# Altium schematic sheet Urukul.SchDoc: =DocumentName
size A3; DocumentNumber: 1; Revision: 0; SheetNumber: 1; SheetTotal: 20; Last modified by: Krzysztof Belewicz
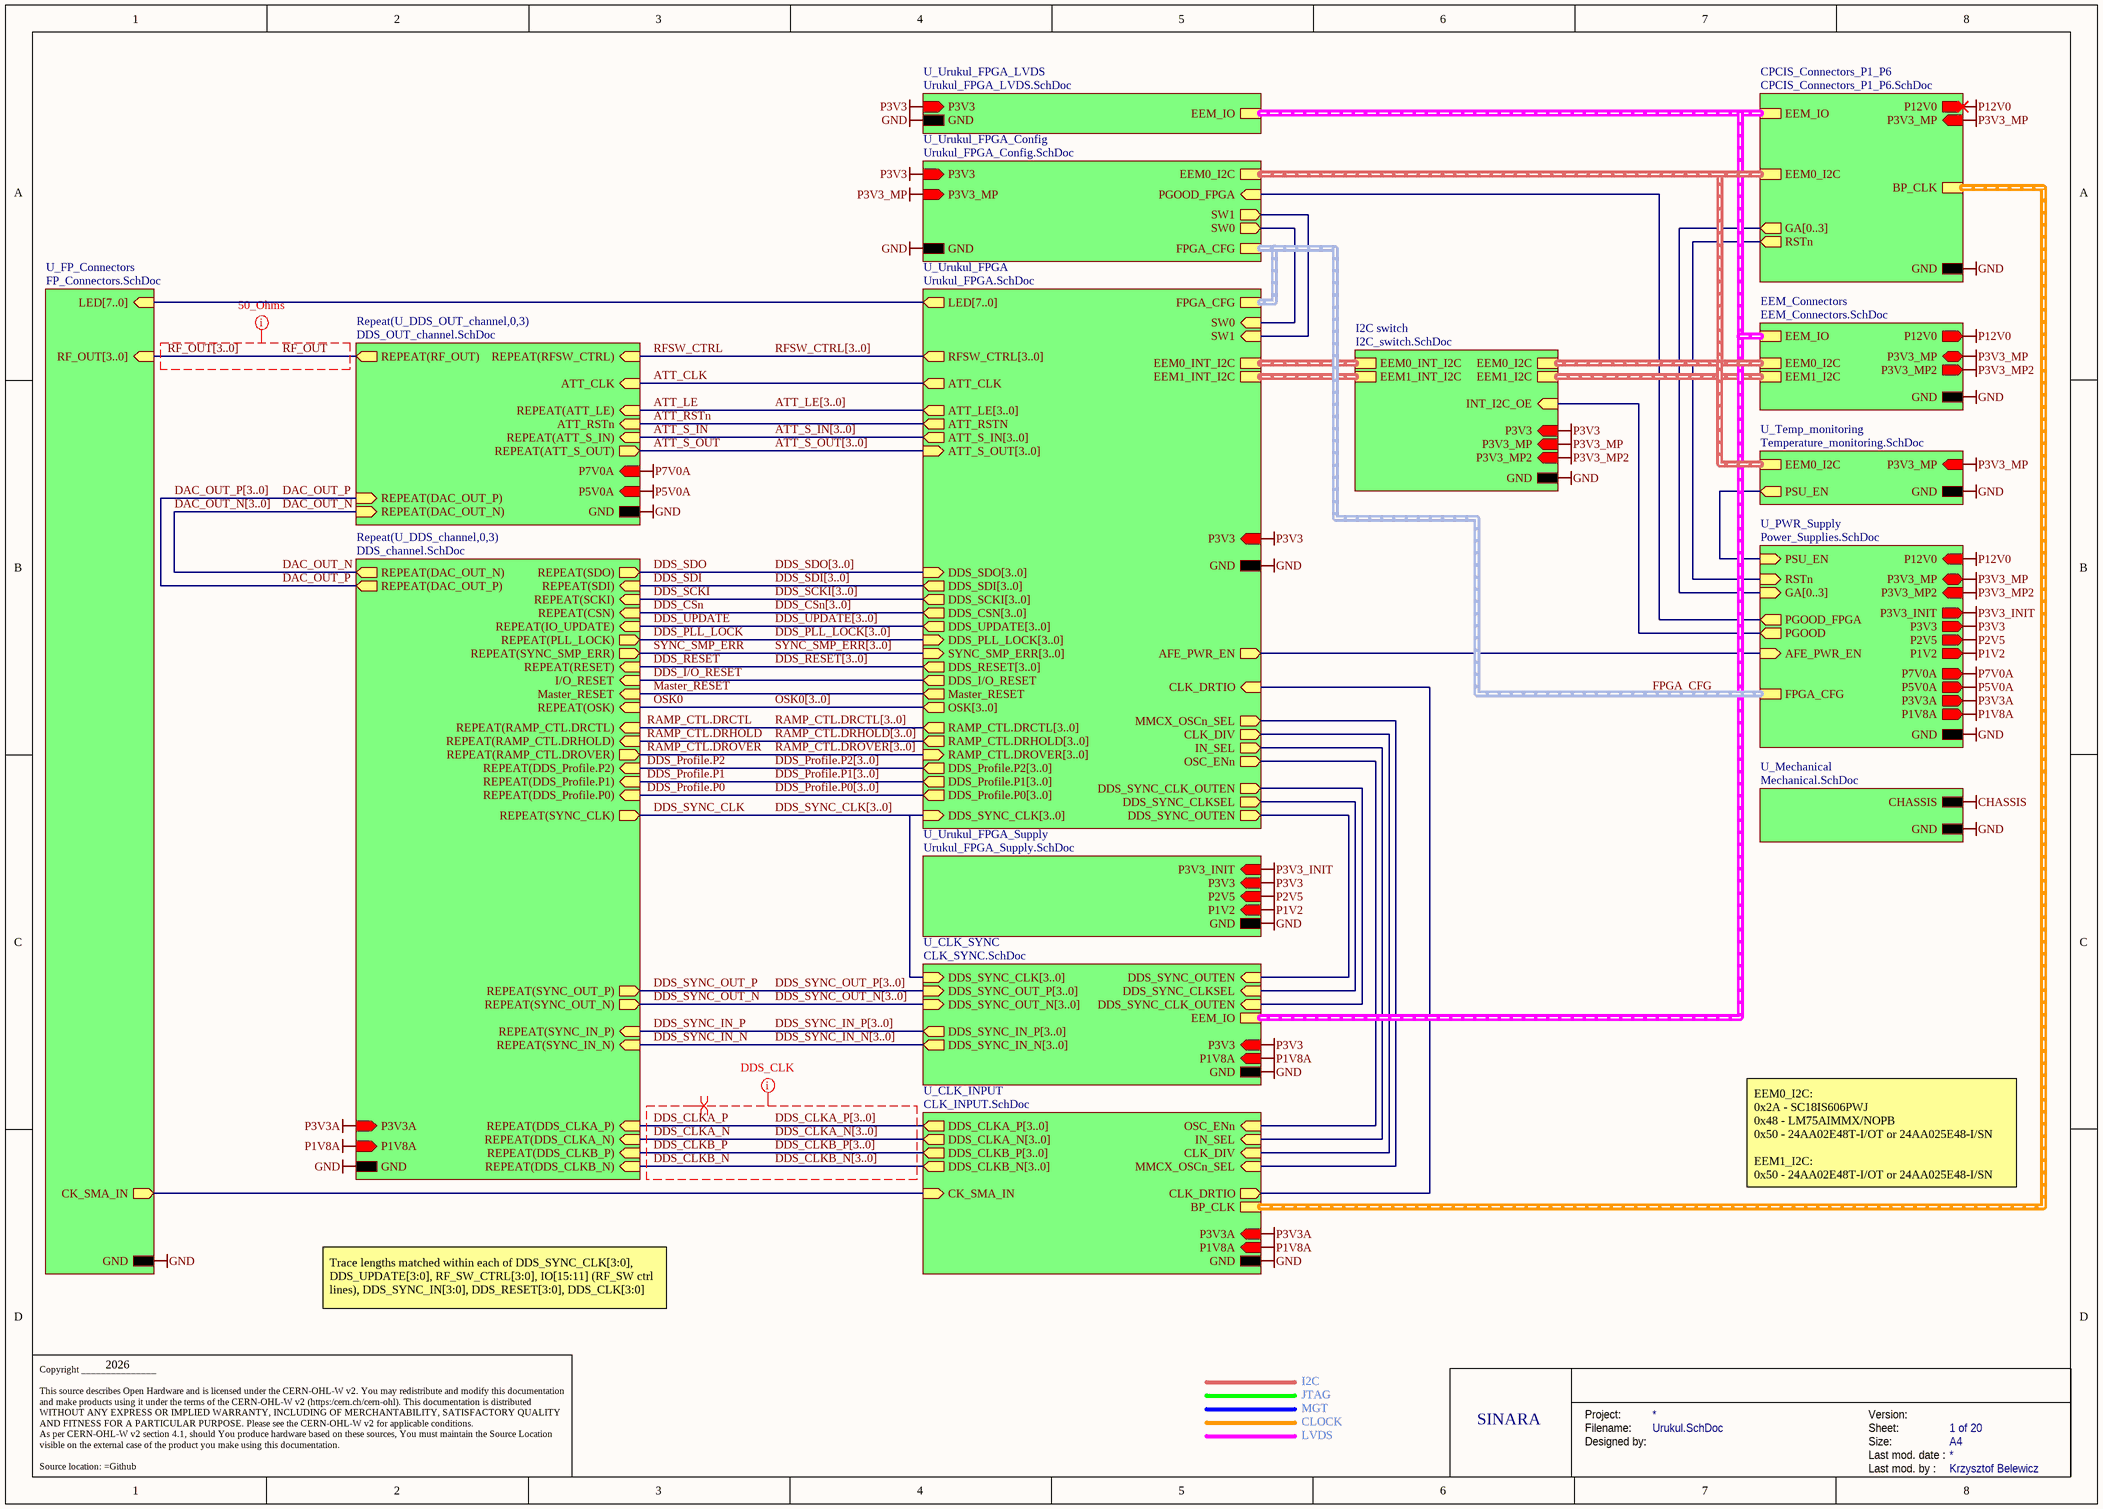
[diagram p0: Urukul.SchDoc]

## Sub-sheets
CPCIS_Connectors_P1_P6 = CPCIS_Connectors_P1_P6.SchDoc: P12V0 (out), P3V3_MP (in), EEM_IO (harness EEM_LVDS), EEM0_I2C (harness I2C), BP_CLK (harness CLK_DIFF), GA[0..3] (out), GND, RSTn (out)
EEM_Connectors = EEM_Connectors.SchDoc: P3V3_MP (bidir), P12V0 (out), EEM_IO (harness EEM_LVDS), EEM0_I2C (harness I2C), GND, P3V3_MP2 (out), EEM1_I2C (harness I2C)
I2C switch = I2C_switch.SchDoc: GND, P3V3 (in), P3V3_MP (in), INT_I2C_OE (in), EEM0_I2C (harness I2C), EEM1_I2C (harness I2C), EEM0_INT_I2C (harness I2C), EEM1_INT_I2C (harness I2C), P3V3_MP2 (in)
Repeat(U_DDS_channel,0,3) = DDS_channel.SchDoc: REPEAT(CSN) (in), REPEAT(SDI) (in), REPEAT(SCKI) (in), REPEAT(SDO) (out), REPEAT(DAC_OUT_P) (out), REPEAT(DAC_OUT_N) (out), REPEAT(RESET) (in), REPEAT(IO_UPDATE) (in), REPEAT(SYNC_CLK) (out), I/O_RESET (in), REPEAT(SYNC_SMP_ERR) (out), REPEAT(PLL_LOCK) (out), Master_RESET (in), REPEAT(OSK) (in), GND, P1V8A (in), P3V3A (in), REPEAT(SYNC_IN_P) (in), REPEAT(SYNC_IN_N) (in), REPEAT(SYNC_OUT_P) (out), REPEAT(SYNC_OUT_N) (out), REPEAT(DDS_CLKB_P) (in), REPEAT(DDS_CLKB_N) (in), REPEAT(DDS_CLKA_P) (in), REPEAT(DDS_CLKA_N) (in), REPEAT(RAMP_CTL.DROVER) (out), REPEAT(RAMP_CTL.DRHOLD) (in), REPEAT(RAMP_CTL.DRCTL) (in), REPEAT(DDS_Profile.P2) (in), REPEAT(DDS_Profile.P1) (in), REPEAT(DDS_Profile.P0) (in)
Repeat(U_DDS_OUT_channel,0,3) = DDS_OUT_channel.SchDoc: REPEAT(RF_OUT) (out), REPEAT(RFSW_CTRL) (in), ATT_CLK (in), REPEAT(ATT_S_IN) (in), REPEAT(ATT_LE) (in), ATT_RSTn (in), REPEAT(ATT_S_OUT) (out), GND, P7V0A (in), P5V0A (in), REPEAT(DAC_OUT_P) (in), REPEAT(DAC_OUT_N) (in)
U_CLK_INPUT = CLK_INPUT.SchDoc: DDS_CLKA_P[3..0] (out), DDS_CLKA_N[3..0] (out), BP_CLK (harness CLK_DIFF), CK_SMA_IN (in), IN_SEL (in), CLK_DIV (in), MMCX_OSCn_SEL (in), OSC_ENn (in), DDS_CLKB_P[3..0] (out), DDS_CLKB_N[3..0] (out), P3V3A (in), GND, P1V8A (in), CLK_DRTIO (out)
U_CLK_SYNC = CLK_SYNC.SchDoc: DDS_SYNC_OUT_P[3..0] (in), DDS_SYNC_OUT_N[3..0] (in), DDS_SYNC_IN_P[3..0] (out), DDS_SYNC_IN_N[3..0] (out), DDS_SYNC_CLK_OUTEN (in), DDS_SYNC_CLKSEL (in), DDS_SYNC_OUTEN (in), EEM_IO (harness EEM_LVDS), DDS_SYNC_CLK[3..0] (in), GND, P3V3 (in), P1V8A (in)
U_FP_Connectors = FP_Connectors.SchDoc: GND, CK_SMA_IN (out), LED[7..0] (in), RF_OUT[3..0] (in)
U_Mechanical = Mechanical.SchDoc: CHASSIS, GND
U_PWR_Supply = Power_Supplies.SchDoc: GND, P12V0 (in), P3V3 (out), P3V3_MP (bidir), PGOOD (out), GA[0..3] (in), RSTn (in), PSU_EN (in), P3V3_MP2 (in), P3V3_INIT (out), P2V5 (out), P1V2 (out), P3V3A (out), P1V8A (out), P5V0A (out), P7V0A (out), AFE_PWR_EN (in), PGOOD_FPGA (out), FPGA_CFG (harness FPGA_CFG)
U_Temp_monitoring = Temperature_monitoring.SchDoc: GND, P3V3_MP (in), EEM0_I2C (harness I2C), PSU_EN (out)
U_Urukul_FPGA = Urukul_FPGA.SchDoc: EEM0_INT_I2C (harness I2C), EEM1_INT_I2C (harness I2C), LED[7..0] (out), FPGA_CFG (harness FPGA_CFG), SW0 (in), RFSW_CTRL[3..0] (out), DDS_SYNC_CLK[3..0] (in), ATT_S_IN[3..0] (out), ATT_S_OUT[3..0] (in), OSK[3..0] (out), ATT_CLK (out), ATT_LE[3..0] (out), ATT_RSTN (out), Master_RESET (out), DDS_UPDATE[3..0] (out), DDS_CSN[3..0] (out), DDS_SCKI[3..0] (out), DDS_SDI[3..0] (out), DDS_SDO[3..0] (in), DDS_I/O_RESET (out), DDS_PLL_LOCK[3..0] (in), SYNC_SMP_ERR[3..0] (in), DDS_RESET[3..0] (out), SW1 (in), GND, P3V3 (in), AFE_PWR_EN (out), DDS_SYNC_CLKSEL (out), DDS_SYNC_OUTEN (out), DDS_SYNC_CLK_OUTEN (out), IN_SEL (out), CLK_DIV (out), MMCX_OSCn_SEL (out), OSC_ENn (out), CLK_DRTIO (in), RAMP_CTL.DRCTL[3..0] (out), RAMP_CTL.DRHOLD[3..0] (out), RAMP_CTL.DROVER[3..0] (in), DDS_Profile.P2[3..0] (out), DDS_Profile.P1[3..0] (out), DDS_Profile.P0[3..0] (out)
U_Urukul_FPGA_Config = Urukul_FPGA_Config.SchDoc: PGOOD_FPGA (in), FPGA_CFG (harness FPGA_CFG), SW0 (out), SW1 (out), GND, P3V3_MP (in), P3V3 (in), EEM0_I2C (harness I2C)
U_Urukul_FPGA_LVDS = Urukul_FPGA_LVDS.SchDoc: EEM_IO (harness EEM_LVDS), GND, P3V3 (in)
U_Urukul_FPGA_Supply = Urukul_FPGA_Supply.SchDoc: P3V3_INIT (in), P3V3 (in), P2V5 (in), P1V2 (in), GND

## Nets
CHASSIS: sheet U_Mechanical/CHASSIS
GND: sheet CPCIS_Connectors_P1_P6/GND, sheet EEM_Connectors/GND, sheet U_Temp_monitoring/GND, sheet U_Mechanical/GND, sheet U_FP_Connectors/GND, sheet U_CLK_INPUT/GND, sheet U_Urukul_FPGA_Supply/GND, sheet Repeat(U_DDS_OUT_channel,0,3)/GND, sheet Repeat(U_DDS_channel,0,3)/GND, sheet U_Urukul_FPGA/GND, sheet U_CLK_SYNC/GND, sheet U_Urukul_FPGA_Config/GND, sheet U_Urukul_FPGA_LVDS/GND, sheet I2C switch/GND, sheet U_PWR_Supply/GND
P1V2: sheet U_Urukul_FPGA_Supply/P1V2, sheet U_PWR_Supply/P1V2
P1V8A: sheet U_CLK_INPUT/P1V8A, sheet Repeat(U_DDS_channel,0,3)/P1V8A, sheet U_CLK_SYNC/P1V8A, sheet U_PWR_Supply/P1V8A
P2V5: sheet U_Urukul_FPGA_Supply/P2V5, sheet U_PWR_Supply/P2V5
P3V3: sheet U_Urukul_FPGA_Supply/P3V3, sheet U_Urukul_FPGA/P3V3, sheet U_CLK_SYNC/P3V3, sheet U_Urukul_FPGA_Config/P3V3, sheet U_Urukul_FPGA_LVDS/P3V3, sheet I2C switch/P3V3, sheet U_PWR_Supply/P3V3
P3V3_INIT: sheet U_Urukul_FPGA_Supply/P3V3_INIT, sheet U_PWR_Supply/P3V3_INIT
P3V3_MP: sheet CPCIS_Connectors_P1_P6/P3V3_MP, sheet EEM_Connectors/P3V3_MP, sheet U_Temp_monitoring/P3V3_MP, sheet U_Urukul_FPGA_Config/P3V3_MP, sheet I2C switch/P3V3_MP, sheet U_PWR_Supply/P3V3_MP
P3V3_MP2: sheet EEM_Connectors/P3V3_MP2, sheet I2C switch/P3V3_MP2, sheet U_PWR_Supply/P3V3_MP2
P3V3A: sheet U_CLK_INPUT/P3V3A, sheet Repeat(U_DDS_channel,0,3)/P3V3A, sheet U_PWR_Supply/P3V3A
P5V0A: sheet Repeat(U_DDS_OUT_channel,0,3)/P5V0A, sheet U_PWR_Supply/P5V0A
P7V0A: sheet Repeat(U_DDS_OUT_channel,0,3)/P7V0A, sheet U_PWR_Supply/P7V0A
P12V0: sheet CPCIS_Connectors_P1_P6/P12V0, sheet EEM_Connectors/P12V0, sheet U_PWR_Supply/P12V0
ATT_CLK: sheet Repeat(U_DDS_OUT_channel,0,3)/ATT_CLK, sheet U_Urukul_FPGA/ATT_CLK
ATT_LE: sheet Repeat(U_DDS_OUT_channel,0,3)/REPEAT(ATT_LE)
ATT_RSTn: sheet Repeat(U_DDS_OUT_channel,0,3)/ATT_RSTn, sheet U_Urukul_FPGA/ATT_RSTN
ATT_S_IN: sheet Repeat(U_DDS_OUT_channel,0,3)/REPEAT(ATT_S_IN)
ATT_S_OUT: sheet Repeat(U_DDS_OUT_channel,0,3)/REPEAT(ATT_S_OUT)
DAC_OUT_N: sheet Repeat(U_DDS_OUT_channel,0,3)/REPEAT(DAC_OUT_N), sheet Repeat(U_DDS_channel,0,3)/REPEAT(DAC_OUT_N)
DAC_OUT_P: sheet Repeat(U_DDS_OUT_channel,0,3)/REPEAT(DAC_OUT_P), sheet Repeat(U_DDS_channel,0,3)/REPEAT(DAC_OUT_P)
DDS_CLKA_N: sheet Repeat(U_DDS_channel,0,3)/REPEAT(DDS_CLKA_N)
DDS_CLKA_P: sheet Repeat(U_DDS_channel,0,3)/REPEAT(DDS_CLKA_P)
DDS_CLKB_N: sheet Repeat(U_DDS_channel,0,3)/REPEAT(DDS_CLKB_N)
DDS_CLKB_P: sheet Repeat(U_DDS_channel,0,3)/REPEAT(DDS_CLKB_P)
DDS_CSn: sheet Repeat(U_DDS_channel,0,3)/REPEAT(CSN)
DDS_I/O_RESET: sheet Repeat(U_DDS_channel,0,3)/I/O_RESET, sheet U_Urukul_FPGA/DDS_I/O_RESET
DDS_PLL_LOCK: sheet Repeat(U_DDS_channel,0,3)/REPEAT(PLL_LOCK)
DDS_Profile.P0: sheet Repeat(U_DDS_channel,0,3)/REPEAT(DDS_Profile.P0)
DDS_Profile.P1: sheet Repeat(U_DDS_channel,0,3)/REPEAT(DDS_Profile.P1)
DDS_Profile.P2: sheet Repeat(U_DDS_channel,0,3)/REPEAT(DDS_Profile.P2)
DDS_RESET: sheet Repeat(U_DDS_channel,0,3)/REPEAT(RESET)
DDS_SCKI: sheet Repeat(U_DDS_channel,0,3)/REPEAT(SCKI)
DDS_SDI: sheet Repeat(U_DDS_channel,0,3)/REPEAT(SDI)
DDS_SDO: sheet Repeat(U_DDS_channel,0,3)/REPEAT(SDO)
DDS_SYNC_CLK: sheet Repeat(U_DDS_channel,0,3)/REPEAT(SYNC_CLK)
DDS_SYNC_IN_N: sheet Repeat(U_DDS_channel,0,3)/REPEAT(SYNC_IN_N)
DDS_SYNC_IN_P: sheet Repeat(U_DDS_channel,0,3)/REPEAT(SYNC_IN_P)
DDS_SYNC_OUT_N: sheet Repeat(U_DDS_channel,0,3)/REPEAT(SYNC_OUT_N)
DDS_SYNC_OUT_P: sheet Repeat(U_DDS_channel,0,3)/REPEAT(SYNC_OUT_P)
DDS_UPDATE: sheet Repeat(U_DDS_channel,0,3)/REPEAT(IO_UPDATE)
Master_RESET: sheet Repeat(U_DDS_channel,0,3)/Master_RESET, sheet U_Urukul_FPGA/Master_RESET
OSK0: sheet Repeat(U_DDS_channel,0,3)/REPEAT(OSK)
RAMP_CTL.DRCTL: sheet Repeat(U_DDS_channel,0,3)/REPEAT(RAMP_CTL.DRCTL)
RAMP_CTL.DRHOLD: sheet Repeat(U_DDS_channel,0,3)/REPEAT(RAMP_CTL.DRHOLD)
RAMP_CTL.DROVER: sheet Repeat(U_DDS_channel,0,3)/REPEAT(RAMP_CTL.DROVER)
RF_OUT: sheet Repeat(U_DDS_OUT_channel,0,3)/REPEAT(RF_OUT)
RFSW_CTRL: sheet Repeat(U_DDS_OUT_channel,0,3)/REPEAT(RFSW_CTRL)
SYNC_SMP_ERR: sheet Repeat(U_DDS_channel,0,3)/REPEAT(SYNC_SMP_ERR)
(unnamed): sheet CPCIS_Connectors_P1_P6/RSTn, sheet U_PWR_Supply/RSTn
(unnamed): sheet U_Temp_monitoring/PSU_EN, sheet U_PWR_Supply/PSU_EN
(unnamed): sheet U_FP_Connectors/CK_SMA_IN, sheet U_CLK_INPUT/CK_SMA_IN
(unnamed): sheet U_CLK_INPUT/IN_SEL, sheet U_Urukul_FPGA/IN_SEL
(unnamed): sheet U_CLK_INPUT/CLK_DIV, sheet U_Urukul_FPGA/CLK_DIV
(unnamed): sheet U_CLK_INPUT/MMCX_OSCn_SEL, sheet U_Urukul_FPGA/MMCX_OSCn_SEL
(unnamed): sheet U_CLK_INPUT/OSC_ENn, sheet U_Urukul_FPGA/OSC_ENn
(unnamed): sheet U_CLK_INPUT/CLK_DRTIO, sheet U_Urukul_FPGA/CLK_DRTIO
(unnamed): sheet U_Urukul_FPGA/SW0, sheet U_Urukul_FPGA_Config/SW0
(unnamed): sheet U_Urukul_FPGA/SW1, sheet U_Urukul_FPGA_Config/SW1
(unnamed): sheet U_Urukul_FPGA/AFE_PWR_EN, sheet U_PWR_Supply/AFE_PWR_EN
(unnamed): sheet U_Urukul_FPGA/DDS_SYNC_CLKSEL, sheet U_CLK_SYNC/DDS_SYNC_CLKSEL
(unnamed): sheet U_Urukul_FPGA/DDS_SYNC_OUTEN, sheet U_CLK_SYNC/DDS_SYNC_OUTEN
(unnamed): sheet U_Urukul_FPGA/DDS_SYNC_CLK_OUTEN, sheet U_CLK_SYNC/DDS_SYNC_CLK_OUTEN
(unnamed): sheet U_Urukul_FPGA_Config/PGOOD_FPGA, sheet U_PWR_Supply/PGOOD_FPGA
(unnamed): sheet I2C switch/INT_I2C_OE, sheet U_PWR_Supply/PGOOD

## Buses and harness runs
bus ATT_LE[3..0] = sheet U_Urukul_FPGA/ATT_LE[3..0]
bus ATT_S_IN[3..0] = sheet U_Urukul_FPGA/ATT_S_IN[3..0]
bus ATT_S_OUT[3..0] = sheet U_Urukul_FPGA/ATT_S_OUT[3..0]
bus DAC_OUT_N[3..0]
bus DAC_OUT_P[3..0]
bus DDS_CLKA_N[3..0] = sheet U_CLK_INPUT/DDS_CLKA_N[3..0]
bus DDS_CLKA_P[3..0] = sheet U_CLK_INPUT/DDS_CLKA_P[3..0]
bus DDS_CLKB_N[3..0] = sheet U_CLK_INPUT/DDS_CLKB_N[3..0]
bus DDS_CLKB_P[3..0] = sheet U_CLK_INPUT/DDS_CLKB_P[3..0]
bus DDS_CSn[3..0] = sheet U_Urukul_FPGA/DDS_CSN[3..0]
bus DDS_PLL_LOCK[3..0] = sheet U_Urukul_FPGA/DDS_PLL_LOCK[3..0]
bus DDS_Profile.P0[3..0] = sheet U_Urukul_FPGA/DDS_Profile.P0[3..0]
bus DDS_Profile.P1[3..0] = sheet U_Urukul_FPGA/DDS_Profile.P1[3..0]
bus DDS_Profile.P2[3..0] = sheet U_Urukul_FPGA/DDS_Profile.P2[3..0]
bus DDS_RESET[3..0] = sheet U_Urukul_FPGA/DDS_RESET[3..0]
bus DDS_SCKI[3..0] = sheet U_Urukul_FPGA/DDS_SCKI[3..0]
bus DDS_SDI[3..0] = sheet U_Urukul_FPGA/DDS_SDI[3..0]
bus DDS_SDO[3..0] = sheet U_Urukul_FPGA/DDS_SDO[3..0]
bus DDS_SYNC_CLK[3..0] = sheet U_CLK_SYNC/DDS_SYNC_CLK[3..0] = sheet U_Urukul_FPGA/DDS_SYNC_CLK[3..0]
bus DDS_SYNC_IN_N[3..0] = sheet U_CLK_SYNC/DDS_SYNC_IN_N[3..0]
bus DDS_SYNC_IN_P[3..0] = sheet U_CLK_SYNC/DDS_SYNC_IN_P[3..0]
bus DDS_SYNC_OUT_N[3..0] = sheet U_CLK_SYNC/DDS_SYNC_OUT_N[3..0]
bus DDS_SYNC_OUT_P[3..0] = sheet U_CLK_SYNC/DDS_SYNC_OUT_P[3..0]
bus DDS_UPDATE[3..0] = sheet U_Urukul_FPGA/DDS_UPDATE[3..0]
bus OSK0[3..0] = sheet U_Urukul_FPGA/OSK[3..0]
bus RAMP_CTL.DRCTL[3..0] = sheet U_Urukul_FPGA/RAMP_CTL.DRCTL[3..0]
bus RAMP_CTL.DRHOLD[3..0] = sheet U_Urukul_FPGA/RAMP_CTL.DRHOLD[3..0]
bus RAMP_CTL.DROVER[3..0] = sheet U_Urukul_FPGA/RAMP_CTL.DROVER[3..0]
bus RF_OUT[3..0] = sheet U_FP_Connectors/RF_OUT[3..0]
bus RFSW_CTRL[3..0] = sheet U_Urukul_FPGA/RFSW_CTRL[3..0]
bus sheet CPCIS_Connectors_P1_P6/GA[0..3] = sheet U_PWR_Supply/GA[0..3]
bus sheet U_FP_Connectors/LED[7..0] = sheet U_Urukul_FPGA/LED[7..0]
bus SYNC_SMP_ERR[3..0] = sheet U_Urukul_FPGA/SYNC_SMP_ERR[3..0]
harness FPGA_CFG = sheet U_PWR_Supply/FPGA_CFG = sheet U_Urukul_FPGA/FPGA_CFG = sheet U_Urukul_FPGA_Config/FPGA_CFG
harness sheet CPCIS_Connectors_P1_P6/BP_CLK = sheet U_CLK_INPUT/BP_CLK
harness sheet CPCIS_Connectors_P1_P6/EEM0_I2C = sheet EEM_Connectors/EEM0_I2C = sheet I2C switch/EEM0_I2C = sheet U_Temp_monitoring/EEM0_I2C = sheet U_Urukul_FPGA_Config/EEM0_I2C
harness sheet CPCIS_Connectors_P1_P6/EEM_IO = sheet EEM_Connectors/EEM_IO = sheet U_CLK_SYNC/EEM_IO = sheet U_Urukul_FPGA_LVDS/EEM_IO
harness sheet EEM_Connectors/EEM1_I2C = sheet I2C switch/EEM1_I2C
harness sheet I2C switch/EEM0_INT_I2C = sheet U_Urukul_FPGA/EEM0_INT_I2C
harness sheet I2C switch/EEM1_INT_I2C = sheet U_Urukul_FPGA/EEM1_INT_I2C

## Layout directives
net class DDS_CLK: DDS_CLKA_N, DDS_CLKA_N[3..0], DDS_CLKA_P, DDS_CLKA_P[3..0], DDS_CLKB_N, DDS_CLKB_N[3..0], DDS_CLKB_P, DDS_CLKB_P[3..0]
net class 50_Ohms: RF_OUT, RF_OUT[3..0]
differential pair: DDS_CLKA_N, DDS_CLKA_N[3..0], DDS_CLKA_P, DDS_CLKA_P[3..0], DDS_CLKB_N, DDS_CLKB_N[3..0], DDS_CLKB_P, DDS_CLKB_P[3..0]

## Notes on the sheet
- EEM0_I2C:
  0x2A - SC18IS606PWJ
  0x48 - LM75AIMMX/NOPB
  0x50 - 24AA02E48T-I/OT or 24AA025E48-I/SN
  EEM1_I2C:
  0x50 - 24AA02E48T-I/OT or 24AA025E48-I/SN
- Trace lengths matched within each of DDS_SYNC_CLK[3:0], DDS_UPDATE[3:0], RF_SW_CTRL[3:0], IO[15:11] (RF_SW ctrl lines), DDS_SYNC_IN[3:0], DDS_RESET[3:0], DDS_CLK[3:0]
- 2026
- I2C
- JTAG
- MGT
- CLOCK
- LVDS
- SINARA
- Project:
- Designed by:
- Filename:
- Size:
- Version:
- Last mod. date :
- Sheet:
- A4
- Copyright _______________
  This source describes Open Hardware and is licensed under the CERN-OHL-W v2. You may redistribute and modify this documentation and make products using it under the terms of the CERN-OHL-W v2 (https:/cern.ch/cern-ohl). This documentation is distributed WITHOUT ANY EXPRESS OR IMPLIED WARRANTY, INCLUDING OF MERCHANTABILITY, SATISFACTORY QUALITY AND FITNESS FOR A PARTICULAR PURPOSE. Please see the CERN-OHL-W v2 for applicable conditions.
  As per CERN-OHL-W v2 section 4.1, should You produce hardware based on these sources, You must maintain the Source Location visible on the external case of the product you make using this documentation.
  Source location: =Github
- Last mod. by :